# Altium schematic sheet Sheet1.SchDoc: Arduino multifunction shield
size B portrait; SheetNumber: 1; SheetTotal: 1; SPICEModelCacheWPXTZUTI: <root> / <DocumentId>WPXTZUTI</DocumentId> / </root>
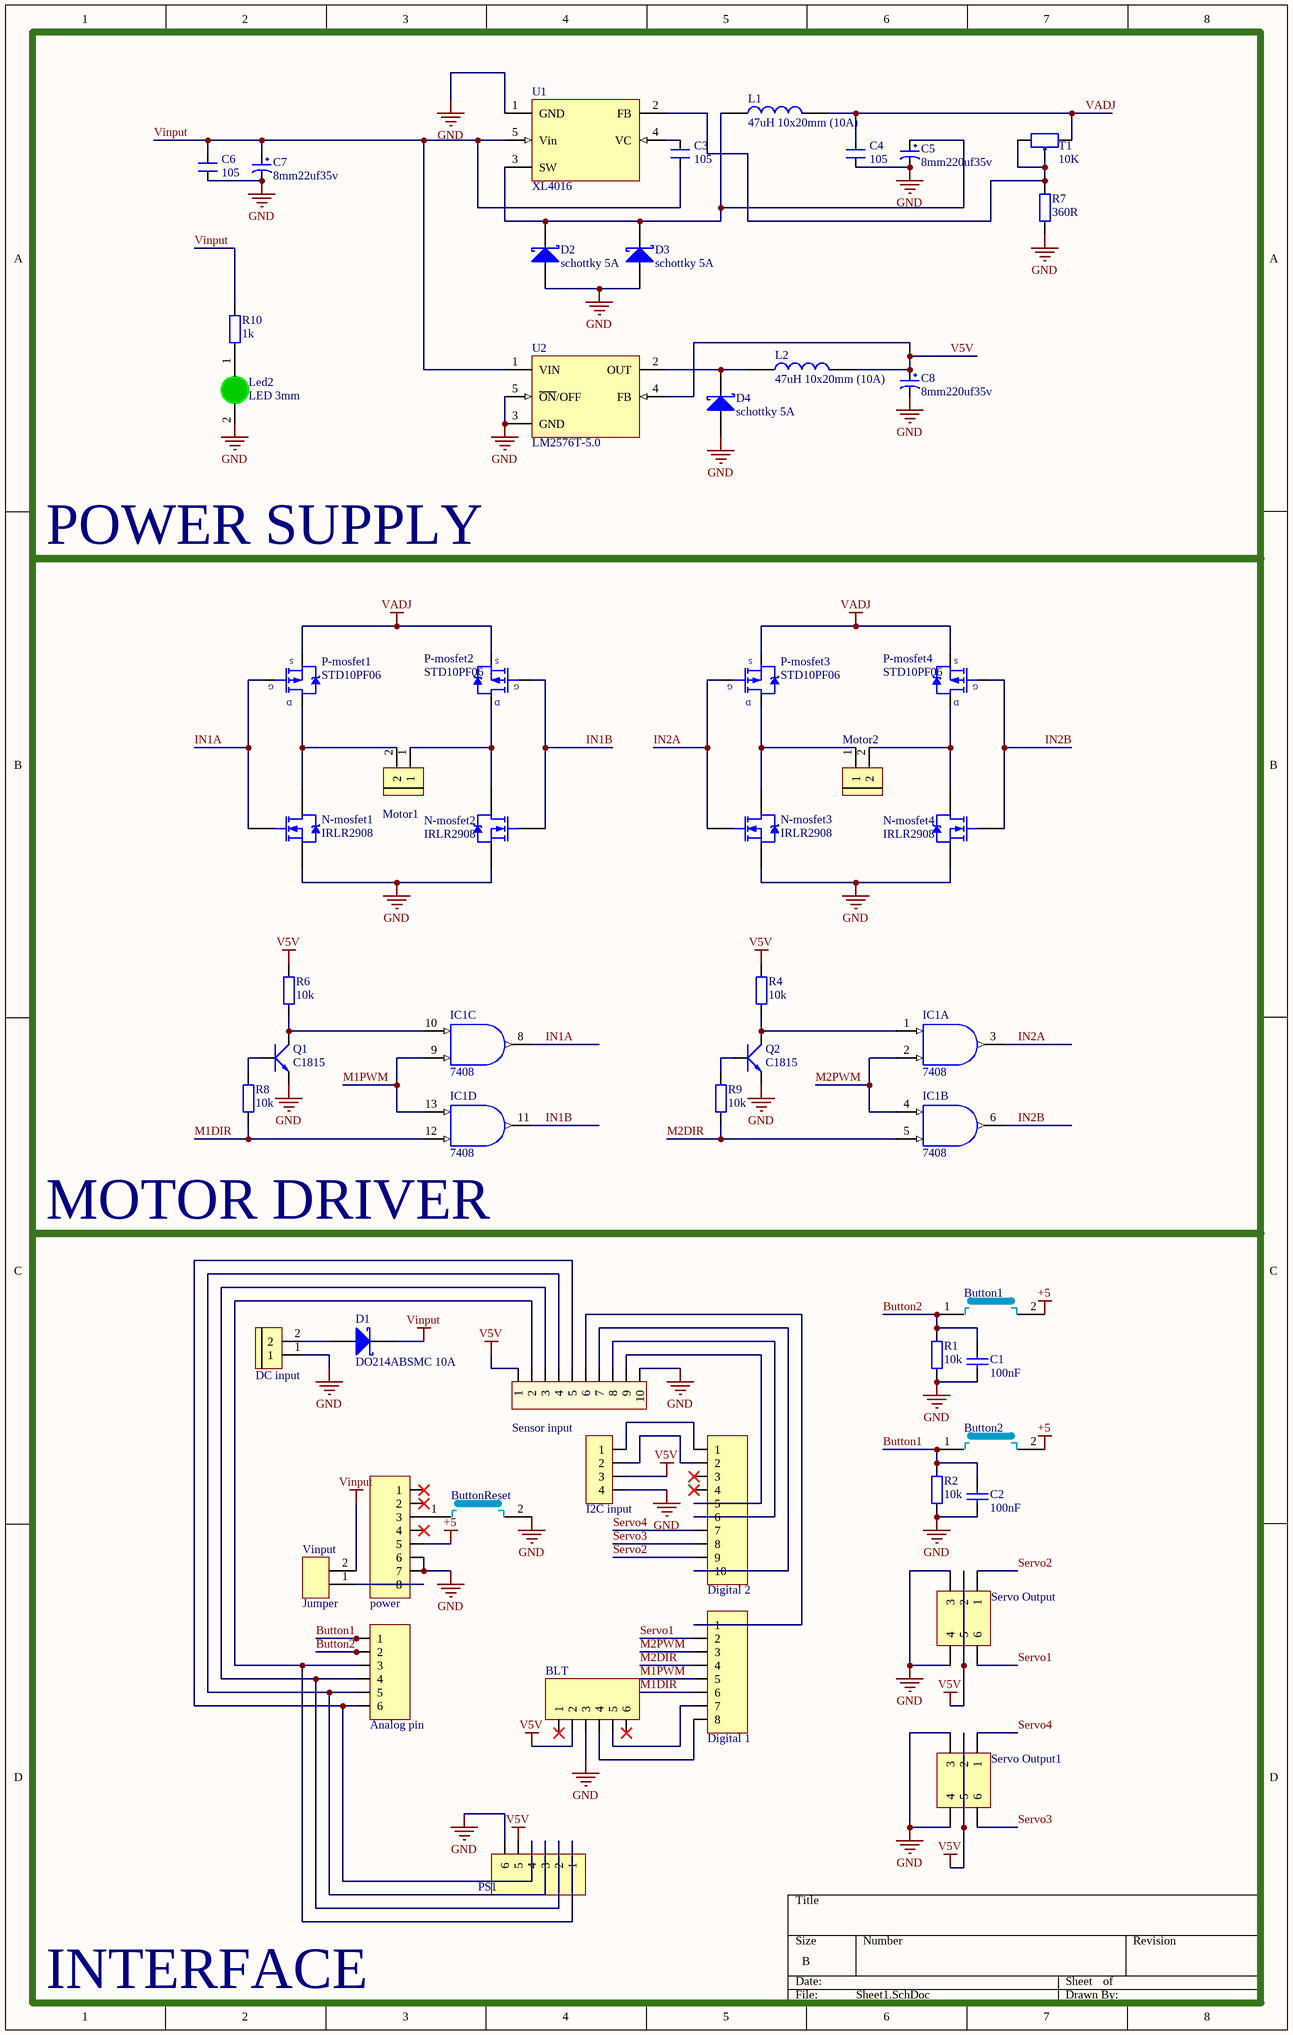
[diagram p0: Sheet1.SchDoc]

## Parts
BLT  JP 1x6 2.54  [JP 1x6 CT]  (value not drawn)
Button1  BT  [SW4]  (value not drawn)
Button2  BT  [SW4]  (value not drawn)
ButtonReset  BT  [SW4]  (value not drawn)
C1  100nF  [tu tantalum dip5.08]
C2  100nF  [tu tantalum dip5.08]
C3  105  [CN2]
C4  105  [CN2]
C5  8mm220uf35v  [tu hoa 8mm]
C6  105  [CN2]
C7  8mm22uf35v  [tu hoa 8mm]
C8  8mm220uf35v  [tu hoa 8mm]
D1  DO214ABSMC 10A  [DIODE_DO214AB_SMC]
D2  schottky 5A  [DIODE_DO214AC_SMA]
D3  schottky 5A  [DIODE_DO214AC_SMA]
D4  schottky 5A  [DIODE_DO214AC_SMA]
DC_input  CON 2 KF7.62  [CON 2 KF7.62]  (value not drawn)
I2C_input  JP 1x4 2.54  [JP 1x4 DT]  (value not drawn)
IC1  7408  [DIP14/W0.3]  (parts A,B,C,D of 4)
JP1  power  [JP 1x8 CT]
JP2  Analog pin  [JP 1x6 CT]
JP3  Digital 2  [JP 1x10 CT]
JP4  Digital 1  [JP 1x8 CT]
L1  47uH 10x20mm (10A)  [IND-20x10mm_TH]
L2  47uH 10x20mm (10A)  [IND-20x10mm_TH]
Led2  LED 3mm  [LED-3MM-GREEN]
Motor1  CON 2 KF7.62  [CON 2 KF7.62]  (value not drawn)
Motor2  CON 2 KF7.62  [CON 2 KF7.62]  (value not drawn)
N-mosfet1  IRLR2908  [TO-252-3_L6.6-W6.1-P4.57-LS9.9-BR-CW]
N-mosfet2  IRLR2908  [TO-252-3_L6.6-W6.1-P4.57-LS9.9-BR-CW]
N-mosfet3  IRLR2908  [TO-252-3_L6.6-W6.1-P4.57-LS9.9-BR-CW]
N-mosfet4  IRLR2908  [TO-252-3_L6.6-W6.1-P4.57-LS9.9-BR-CW]
P-mosfet1  STD10PF06  [TO-252-3_L6.6-W6.1-P4.57-LS9.9-BR-CW]
P-mosfet2  STD10PF06  [TO-252-3_L6.6-W6.1-P4.57-LS9.9-BR-CW]
P-mosfet3  STD10PF06  [TO-252-3_L6.6-W6.1-P4.57-LS9.9-BR-CW]
P-mosfet4  STD10PF06  [TO-252-3_L6.6-W6.1-P4.57-LS9.9-BR-CW]
PS1  JP 1x6 2.54  [JP 1x6 CT]  (value not drawn)
Q1  C1815  [QTO-92]
Q2  C1815  [QTO-92]
R1  10k  [tro vach 1/4w]
R2  10k  [tro vach 1/4w]
R4  10k  [R1/4W1]
R6  10k  [R1/4W1]
R7  360R  [R1/4W1]
R8  10k  [R1/4W1]
R9  10k  [R1/4W1]
R10  1k  [R1/4W1]
Sensor_input  Header 10P 2.54 Duc Thang  [XH2.54M-10]  (value not drawn)
Servo_Output  (no value)  [JP 2x3 DT]
Servo_Output1  (no value)  [JP 2x3 DT]
T1  10K  [Bien Tro Vi Chinh Dung]
U1  XL4016  [LM2576t]
U2  LM2576T-5.0  [LM2576t]
Vinput  Jumper  [Jumper]

## Blocks framed on the sheet
POWER SUPPLY: C3-C8 D2-D4 L1 L2 Led2 R7 R10 T1 U1 U2
MOTOR DRIVER: IC1 Motor1 Motor2 N-mosfet1-N-mosfet4 P-mosfet1-P-mosfet4 Q1 Q2 R4 R6 R8 R9
INTERFACE: BLT Button1 Button2 ButtonReset C1 C2 D1 DC_input I2C_input JP1-JP4 PS1 R1 R2 Sensor_input Servo_Output Servo_Output1 Vinput

## Nets
+5: Button1.2 Button2.2 JP1.5
GND: BLT.3 ButtonReset.2 C1.2 C2.2 C4.1 C5.2 C6.1 C7.2 C8.2 D2.1(A) D3.1(A) D4.1(A) DC_input.1 I2C_input.4 IC1.7(GND) JP1.6 JP1.7 Led2.2(K) N-mosfet1.3(S) N-mosfet2.3(S) N-mosfet3.3(S) N-mosfet4.3(S) PS1.6 Q1.1(E) Q2.1(E) R1.1 R2.1 R7.1 Sensor_input.10 Servo_Output.3 Servo_Output.4 Servo_Output1.3 Servo_Output1.4 U1.1(GND) U2.3(GND) U2.5(~{ON}/OFF)
V5V: BLT.2 C8.1 I2C_input.3 L2.2 PS1.5 R4.2 R6.2 Sensor_input.1 Servo_Output.2 Servo_Output.5 Servo_Output1.2 Servo_Output1.5 U2.4(FB)
VADJ: C4.2 L1.2 P-mosfet1.3(S) P-mosfet2.3(S) P-mosfet3.3(S) P-mosfet4.3(S) T1.1
VCC: IC1.14(VCC)
Vinput: C3.1 C6.2 C7.1 D1.2(K) R10.2 U1.5(Vin) U2.1(VIN) Vinput.2
Button1: Button2.1 C2.1 JP2.1 R2.2
Button2: Button1.1 C1.1 JP2.2 R1.2
IN1A: IC1.8(O) N-mosfet1.1(G) P-mosfet1.1(G)
IN1B: IC1.11(O) N-mosfet2.1(G) P-mosfet2.1(G)
IN2A: IC1.3(O) N-mosfet3.1(G) P-mosfet3.1(G)
IN2B: IC1.6(O) N-mosfet4.1(G) P-mosfet4.1(G)
M1DIR: IC1.12(B) JP4.6 R8.1
M1PWM: IC1.9(B) IC1.13(A) JP4.5
M2DIR: IC1.5(B) JP4.4 R9.1
M2PWM: IC1.2(B) IC1.4(A) JP4.3
Servo1: JP4.2 Servo_Output.6
Servo2: JP3.9 Servo_Output.1
Servo3: JP3.8 Servo_Output1.6
Servo4: JP3.7 Servo_Output1.1
NetBLT_4: BLT.4 JP4.8
NetBLT_5: BLT.5 JP4.7
NetButtonReset_1: ButtonReset.1 JP1.3
NetC3_2: C3.2 U1.4(VC)
NetC5_1: C5.1 D2.2(K) D3.2(K) L1.1 U1.3(SW)
NetD1_1: D1.1(A) DC_input.2
NetD4_2: D4.2(K) L2.1 U2.2(OUT)
NetI2C_input_1: I2C_input.1 JP3.1
NetI2C_input_2: I2C_input.2 JP3.2
NetIC1_1: IC1.1(A) Q2.2(C) R4.1
NetIC1_10: IC1.10(A) Q1.2(C) R6.1
NetJP1_8: JP1.8 Vinput.1
NetJP2_3: JP2.3 PS1.1 Sensor_input.2
NetJP2_4: JP2.4 PS1.2 Sensor_input.3
NetJP2_5: JP2.5 PS1.3 Sensor_input.4
NetJP2_6: JP2.6 PS1.4 Sensor_input.5
NetJP3_5: JP3.5 Sensor_input.9
NetJP3_6: JP3.6 Sensor_input.8
NetJP3_10: JP3.10 Sensor_input.7
NetJP4_1: JP4.1 Sensor_input.6
NetLed2_1: Led2.1(A) R10.1
NetMotor1_1: Motor1.1 N-mosfet2.2(D) P-mosfet2.2(D)
NetMotor1_2: Motor1.2 N-mosfet1.2(D) P-mosfet1.2(D)
NetMotor2_1: Motor2.1 N-mosfet3.2(D) P-mosfet3.2(D)
NetMotor2_2: Motor2.2 N-mosfet4.2(D) P-mosfet4.2(D)
NetQ1_3: Q1.3(B) R8.2
NetQ2_3: Q2.3(B) R9.2
NetR7_2: R7.2 T1.2 T1.3 U1.2(FB)

Not connected (* = marked no-connect by the designer): BLT 1* 6*; JP1 1* 2* 4*; JP3 3* 4*

## Library data of the parts
BLT = JP 1x6 2.54 Cai Thang: Cắm; Ten_Linh_Kien: Jump Đơn Cái 2.54MM 1x20P Thẳng; Don_Vi: Con; Ma_Hang: MH004006; Ghi_Chu: *; Kieu_Chan: *; Chung_Loai: Cắm
Button1 Button2 ButtonReset = BUTTON
C1 C2 = Tu tantalum 100nF 50V 20% DIP5.08: Cắm; Don_Vi: Con; So_Chan: 2; Ten_Linh_Kien: Tụ tantalum 104-100nF 50V 20% DIP5.08 (sứ vàng)(10PCS); Ma_Hang: MH003955; Chung_Loai: Cắm; Kieu_Chan: *
C3 C4 C6 = CN2: Cap np 104 => 105pF; Value: 0.1uF
C5 C7 C8 = Tu Hoa 1000uF 25V 13x21: Cắm; Don_Vi: Con; So_Chan: 2; Ten_Linh_Kien: Tụ Hóa 1000uF 25V 13x21MM; Ma_Hang: MH002315; Chung_Loai: Cắm; Kieu_Chan: *
D1 = B540C-13-F: DIODE SCHOTTKY 40V 5A SMC; CompanyID: VT-00370; Solder: SMT; Value: 40V/5A; MPN: B540C-13-F
D2-D4 = B160-13-F: DIODE SCHOTTKY 60V 1A SMA DO-214A; CompanyID: VT-00897; Value: 60V/1A; Solder: SMT; MPN: B160-13-F; MFR: *
DC_input Motor1 Motor2 = CON 2 KF7.62: Cắm; Ma_Hang: MH002053; Ten_Linh_Kien: CON 2 KF7.62-2P 7.62MM (Đen Thẳng); Chung_Loai: Cắm; Ghi_Chu: *; Kieu_Chan: *; Don_Vi: Con
I2C_input = JP 1x4 2.54 Duc Thang: Cắm; Ten_Linh_Kien: Jump Đơn Đực 2.54MM 1x40P Thẳng 11MM; Don_Vi: Con; Ma_Hang: MH000903; Ghi_Chu: *; Kieu_Chan: *; Chung_Loai: Cắm
IC1 = 7408: Quad 2-Input AND Gate; Value: 7408
JP1 JP4 = JP 1x8 2.54 Duc Thang: Cắm; Ten_Linh_Kien: Jump Đơn Đực 2.54MM 1x40P Thẳng 11MM; Don_Vi: Con; Ma_Hang: MH000903; Ghi_Chu: *; Kieu_Chan: *; Chung_Loai: Cắm
JP2 = JP 1x6 2.54 Duc Thang: Cắm; Ten_Linh_Kien: Jump Đơn Đực 2.54MM 1x40P Thẳng 11MM; Don_Vi: Con; Ma_Hang: MH000903; Ghi_Chu: *; Kieu_Chan: *; Chung_Loai: Cắm
JP3 = JP 1x10 2.54 Duc Thang: Cắm; Ten_Linh_Kien: Jump Đơn Đực 2.54MM 1x40P Thẳng 11MM; Don_Vi: Con; Ma_Hang: MH000903; Ghi_Chu: *; Kieu_Chan: *; Chung_Loai: Cắm
L1 L2 = IND_33uH_10A: FIXED IND 33UH 10A 7 MOHM 20x10mm; MPN: IND_33uH_10A; Value: 33uH; Category: INDUCTOR; PinCount: 2; ComponentLink1Description: MFR Link; ComponentLink1URL: https://item.taobao.com/item.htm?spm=a230r.1.14.40.67d1582cjSsbUh&id=591345290045
Led2 = LED 3mm Xanh La: Cắm; Don_Vi: Con; Ma_Hang: MH001054; Ten_Linh_Kien: Led 3MM Phủ Xanh (10c); Ghi_Chu: *; Kieu_Chan: *; Chung_Loai: Cắm
N-mosfet1-N-mosfet4 = IRF3709S SMD: N-Channel Power MOSFET
P-mosfet1-P-mosfet4 = AO D409: P-Channel Power MOSFET; Note: Pin 2 is electrically connected to pin 4.; Published: 8-Jun-2000; LatestRevisionDate: 17-Jul-2002; LatestRevisionNote: Re-released for DXP Platform.; DatasheetVersion: PD-9.421C; PackageVersion: Feb-1997; PackageReference: TO-220AB; Publisher: Altium Limited; PackageDescription: TO, Thru-Hole, Vertical, Heatsink Mounted; 3 In-Line Leads; Pitch 2.54 mm; ComponentLink1Description: Manufacturer Link; ComponentLink1URL: http://www.irf.com/; ComponentLink2Description: Datasheet; ComponentLink2URL: http://www.irf.com/product-info/datasheets/data/irf9540.pdf
PS1 = JP 1x6 2.54 Cai Cong: Cắm; Ten_Linh_Kien: Jump Đơn Cái 2.54MM 1x40P Cong; Don_Vi: Con; Ma_Hang: MH001265; Ghi_Chu: *; Kieu_Chan: *; Chung_Loai: Cắm
Q1 Q2 = C1815: NPN 600mW, ECB; Value: C1815
R1 R2 = Tro Vach 1/4W 5% 10k: Căm; Chung_Loai: Cắm; Don_Vi: Con; So_Chan: 2; Ten_Linh_Kien: Trở Vạch 1/4w 5% 10K; Ma_Hang: MH007354; Kieu_Chan: *
R4 R6 R8-R10 = R1/4W: Resistor 1/4W; Value: R1/4W - 1K
R7 = Tro Vach 1/4W 1% 360R: Cắm; Don_Vi: Con; So_Chan: 2; Ten_Linh_Kien: Trở Vạch 1/4W 1% 360R; Ma_Hang: MH008835; Chung_Loai: Cắm; Kieu_Chan: *
Sensor_input = Header 10P 2.54 Duc Thang: Cắm; Ten_Linh_Kien: Header 10P XH2.54-10P Đực Thẳng; Don_Vi: Con; Ma_Hang: MH001286; Chung_Loai: Cắm
Servo_Output Servo_Output1 = JP 2x3 2.54 Duc Thang: Cắm; Ten_Linh_Kien: Jump Đôi Đực 2.54MM 2x40P Thẳng 11MM; Don_Vi: Con; Ma_Hang: MH002686; Ghi_Chu: *; Kieu_Chan: *; Chung_Loai: Cắm
T1 = Bien Tro Tinh Chinh 10K Dung: Cắm; Ma_Hang: MH003232; Ten_Linh_Kien: Biến Trở VR 103-10K 3296W; Don_Vi: Con; Kieu_Chan: *; Chung_Loai: Cắm; Ghi_Chu: *
U1 U2 = LM2576T-5.0: SIMPLE SWITCHER; 3A Step-Down Voltage Regulator; Manufacturer: National Semiconductor; PackageTopMarking: NSUZXYTT*LM2576T*-5.0 P+; PowerWise: N; FirstPublished: 4-Dec-2008; DatasheetVersion: Aug-2004; PackageVersion: revJ, Jan-1992; PackageReference: T05A; Publisher: Altium Limited; PackageDescription: TO-220, Molded, 5 Lead, Straight; CompType: Switcher; PartNumber: LM2576T-5.0; RoHS: O; PinCount: 5; DigiKeyPartNumber: LM2576T-5.0-ND; Code_JEDEC: TO-220-AB; ComponentLink1Description: LM2576 Datasheet; ComponentLink1URL: http://www.national.com/ds/LM/LM2576.pdf; ComponentLink2Description: LM2576 Web Page; ComponentLink2URL: http://www.national.com/pf/LM/LM2576.html; ComponentLink3Description: T05A Package Page; ComponentLink3URL: http://www.national.com/packaging/folders/t05a.html
Vinput = CMP-002-00080-4: Oreki; Pins: 2; Component Type: Connectors